# Altium schematic sheet ATRACK_HOST_V1.SchDoc
size A4
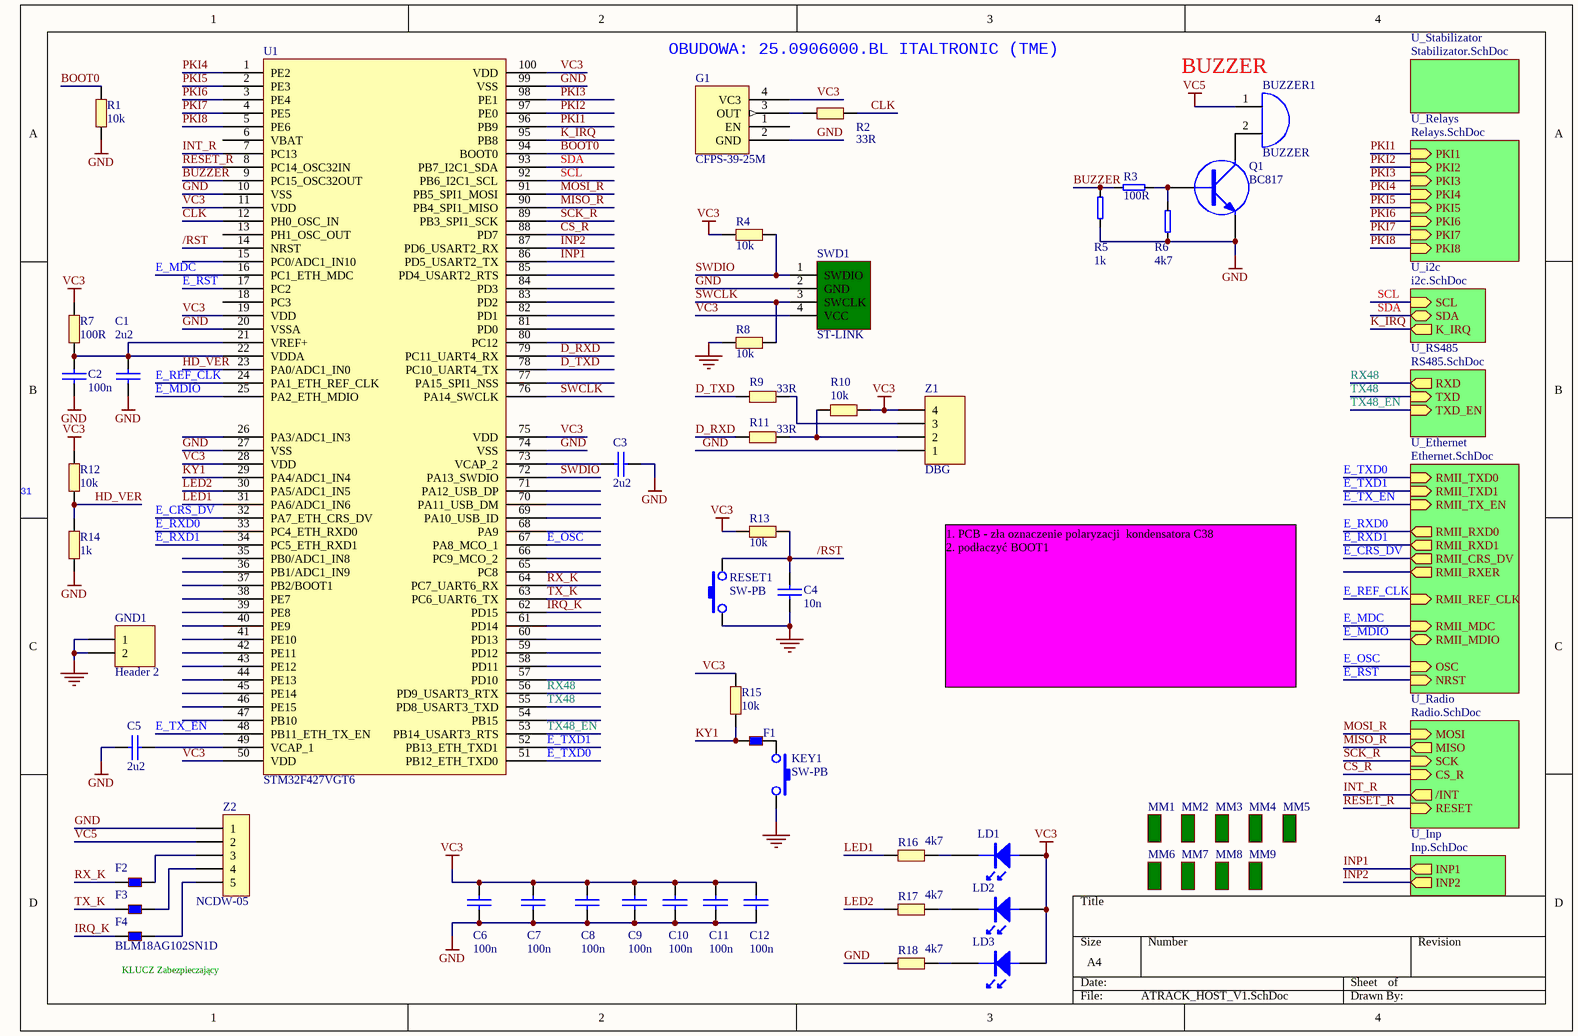
[diagram p0: ATRACK_HOST_V1.SchDoc]

## Parts
BUZZER1  BUZZER  [BMT-1205H09B]
C1  2u2  [0603C]
C2  100n  [0603C]
C3  2u2  [0603C]
C4  10n  [0603C]
C5  2u2  [0603C]
C6  100n  [0603C]
C7  100n  [0603C]
C8  100n  [0603C]
C9  100n  [0603C]
C10  100n  [0603C]
C11  100n  [0603C]
C12  100n  [0603C]
F1  BLM18BB141SN1D  [0603L]  (value not drawn)
F2  BLM18AG102SN1D  [0603L]  (value not drawn)
F3  BLM18AG102SN1D  [0603L]  (value not drawn)
F4  BLM18AG102SN1D  [0603L]
G1  CFPS-39-25M  [GEN_SMD1_1]
GND1  Header 2  [HDR1X2]
KEY1  SW-PB  [DTSM31N_2]
LD1  (no value)  [0805LG]
LD2  (no value)  [0805LR]
LD3  (no value)  [0805LG]
MM1  (no value)  [REF_CIR]
MM2  (no value)  [REF_CIR]
MM3  (no value)  [REF_SQR]
MM4  (no value)  [REF_SQR]
MM5  (no value)  [PB_FREE_GRAF]
MM6  (no value)  [REF_CIR]
MM7  (no value)  [REF_CIR]
MM8  (no value)  [REF_SQR]
MM9  (no value)  [REF_SQR]
Q1  BC817  [SOT23-3Q]
R1  10k  [0603R]
R2  33R  [0603R]
R3  100R  [0603R]
R4  10k  [0603R]
R5  1k  [0603R]
R6  4k7  [0603R]
R7  100R  [0603R]
R8  10k  [0603R]
R9  33R  [0603R]
R10  10k  [0603R]
R11  33R  [0603R]
R12  10k  [0603R]
R13  10k  [0603R]
R14  1k  [0603R]
R15  10k  [0603R]
R16  4k7  [0603R]
R17  4k7  [0603R]
R18  4k7  [0603R]
RESET1  SW-PB  [DTSM31N_2]
SWD1  ST-LINK  [PIN4]
U1  STM32F427VGT6  [VQ100_2]
Z1  DBG  [PIN4]
Z2  NCDW-05  [KEY_LOG]

## Sub-sheets
U_Ethernet = Ethernet.SchDoc: RMII_TXD0 (in), RMII_TX_EN (in), RMII_RXD0 (out), RMII_REF_CLK (in), RMII_CRS_DV (out), RMII_MDC (in), RMII_MDIO (bidir), NRST (in), RMII_TXD1 (in), RMII_RXD1 (out), RMII_RXER (out), OSC (in)
U_i2c = i2c.SchDoc: SCL (in), SDA (bidir), K_IRQ (out)
U_Inp = Inp.SchDoc: INP1 (out), INP2 (out)
U_Radio = Radio.SchDoc: CS_R (in), MOSI (in), MISO (out), SCK (in), RESET (in), /INT (out)
U_Relays = Relays.SchDoc: PKI1 (in), PKI2 (in), PKI3 (in), PKI4 (in), PKI5 (in), PKI6 (in), PKI7 (in), PKI8 (in)
U_RS485 = RS485.SchDoc: TXD (in), TXD_EN (in), RXD (out)
U_Stabilizator = Stabilizator.SchDoc: no entries

## Nets
GND: C1.2 C2.2 C3.1 C4.2 C5.1 C6.2 C7.2 C8.2 C9.2 C10.2 C11.2 C12.2 G1.2(GND) GND1.1 GND1.2 KEY1.2 Q1.E R1.2 R5.2 R6.2 R8.1 R14.1 R18.2 RESET1.1 SWD1.2(GND) U1.10(VSS) U1.20(VSSA) U1.27(VSS) U1.74(VSS) U1.99(VSS) Z1.1 Z2.1
VC3: C6.1 C7.1 C8.1 C9.1 C10.1 C11.1 C12.1 G1.4(VC3) LD1.A LD2.A LD3.A R4.1 R7.2 R10.2 R12.2 R13.1 R15.2 SWD1.4(VCC) U1.11(VDD) U1.19(VDD) U1.28(VDD) U1.50(VDD) U1.75(VDD) U1.100(VDD) Z1.4
VC5: BUZZER1.1 Z2.2
/RST: C4.1 R13.2 RESET1.2 U1.14(NRST)
BOOT0: R1.1 U1.94(BOOT0)
BUZZER: R3.2 R5.1 U1.9(PC15_OSC32OUT)
CLK: R2.2 U1.12(PH0_OSC_IN)
CS_R: U1.88(PD7) ; sheet U_Radio/CS_R
D_RXD: R11.2 U1.79(PC11_UART4_RX)
D_TXD: R9.2 U1.78(PC10_UART4_TX)
E_CRS_DV: U1.32(PA7_ETH_CRS_DV) ; sheet U_Ethernet/RMII_CRS_DV
E_MDC: U1.16(PC1_ETH_MDC) ; sheet U_Ethernet/RMII_MDC
E_MDIO: U1.25(PA2_ETH_MDIO) ; sheet U_Ethernet/RMII_MDIO
E_OSC: U1.67(PA8_MCO_1) ; sheet U_Ethernet/OSC
E_REF_CLK: U1.24(PA1_ETH_REF_CLK) ; sheet U_Ethernet/RMII_REF_CLK
E_RST: U1.17(PC2) ; sheet U_Ethernet/NRST
E_RXD0: U1.33(PC4_ETH_RXD0) ; sheet U_Ethernet/RMII_RXD0
E_RXD1: U1.34(PC5_ETH_RXD1) ; sheet U_Ethernet/RMII_RXD1
E_TX_EN: U1.48(PB11_ETH_TX_EN) ; sheet U_Ethernet/RMII_TX_EN
E_TXD0: U1.51(PB12_ETH_TXD0) ; sheet U_Ethernet/RMII_TXD0
E_TXD1: U1.52(PB13_ETH_TXD1) ; sheet U_Ethernet/RMII_TXD1
HD_VER: R12.1 R14.2 U1.23(PA0/ADC1_IN0)
INP1: U1.86(PD5_USART2_TX) ; sheet U_Inp/INP1
INP2: U1.87(PD6_USART2_RX) ; sheet U_Inp/INP2
INT_R: U1.7(PC13) ; sheet U_Radio//INT
IRQ_K: F4.1 U1.62(PD15)
K_IRQ: U1.95(PB8) ; sheet U_i2c/K_IRQ
KY1: F1.2 R15.1 U1.29(PA4/ADC1_IN4)
LED1: R16.2 U1.31(PA6/ADC1_IN6)
LED2: R17.2 U1.30(PA5/ADC1_IN5)
MISO_R: U1.90(PB4_SPI1_MISO) ; sheet U_Radio/MISO
MOSI_R: U1.91(PB5_SPI1_MOSI) ; sheet U_Radio/MOSI
PKI1: U1.96(PB9) ; sheet U_Relays/PKI1
PKI2: U1.97(PE0) ; sheet U_Relays/PKI2
PKI3: U1.98(PE1) ; sheet U_Relays/PKI3
PKI4: U1.1(PE2) ; sheet U_Relays/PKI4
PKI5: U1.2(PE3) ; sheet U_Relays/PKI5
PKI6: U1.3(PE4) ; sheet U_Relays/PKI6
PKI7: U1.4(PE5) ; sheet U_Relays/PKI7
PKI8: U1.5(PE6) ; sheet U_Relays/PKI8
RESET_R: U1.8(PC14_OSC32IN) ; sheet U_Radio/RESET
RX48: U1.56(PD9_USART3_RTX) ; sheet U_RS485/RXD
RX_K: F2.1 U1.64(PC7_UART6_RX)
SCK_R: U1.89(PB3_SPI1_SCK) ; sheet U_Radio/SCK
SCL: U1.92(PB6_I2C1_SCL) ; sheet U_i2c/SCL
SDA: U1.93(PB7_I2C1_SDA) ; sheet U_i2c/SDA
SWCLK: R8.2 SWD1.3(SWCLK) U1.76(PA14_SWCLK)
SWDIO: R4.2 SWD1.1(SWDIO) U1.72(PA13_SWDIO)
TX48: U1.55(PD8_USART3_TXD) ; sheet U_RS485/TXD
TX48_EN: U1.53(PB14_USART3_RTS) ; sheet U_RS485/TXD_EN
TX_K: F3.1 U1.63(PC6_UART6_TX)
NetBUZZER1_2: BUZZER1.2 Q1.C
NetC1_1: C1.1 C2.1 R7.1 U1.21(VREF+) U1.22(VDDA)
NetC3_2: C3.2 U1.73(VCAP_2)
NetC5_2: C5.2 U1.49(VCAP_1)
NetF1_1: F1.1 KEY1.1
NetF2_2: F2.2 Z2.3
NetF3_2: F3.2 Z2.4
NetF4_2: F4.2 Z2.5
NetG1_3: G1.3(OUT) R2.1
NetLD1_K: LD1.K R16.1
NetLD2_K: LD2.K R17.1
NetLD3_K: LD3.K R18.1
NetQ1_B: Q1.B R3.1 R6.1
NetR9_1: R9.1 Z1.3
NetR10_1: R10.1 R11.1 Z1.2

Not connected (* = marked no-connect by the designer): G1 1(EN); U1 6(VBAT) 13(PH1_OSC_OUT) 15(PC0/ADC1_IN10) 18(PC3) 26(PA3/ADC1_IN3) 35(PB0/ADC1_IN8) 36(PB1/ADC1_IN9) 37(PB2/BOOT1) 38(PE7) 39(PE8) 40(PE9) 41(PE10) 42(PE11) 43(PE12) 44(PE13) 45(PE14) 46(PE15) 47(PB10) 54(PB15) 57(PD10) 58(PD11) 59(PD12) 60(PD13) 61(PD14) 65(PC8) 66(PC9_MCO_2) 68(PA9) 69(PA10_USB_ID) 70(PA11_USB_DM) 71(PA12_USB_DP) 77(PA15_SPI1_NSS) 80(PC12) 81(PD0) 82(PD1) 83(PD2) 84(PD3) 85(PD4_USART2_RTS)

## Notes on the sheet
- OBUDOWA: 25.0906000.BL ITALTRONIC (TME)
- (near BUZZER1) BUZZER
- 31
- 1. PCB - zła oznaczenie polaryzacji  kondensatora C38
  2. podłaczyć BOOT1
- (near F4) KLUCZ Zabezpieczający

## Library data of the parts
C1-C12 = CAP: Capacitor
F1-F4 = KORALIK: Koralik ferrytowy
G1 = GENER_SMD
GND1 = Header 2: Header, 2-Pin; LatestRevisionDate: 17-Jul-2002; LatestRevisionNote: Re-released for DXP Platform.; Publisher: Altium Limited
LD1-LD3 = LED
MM1-MM9 = MECH
Q1 = NPN-SOT23: NPN Transistor
R1 R2 R4 R7-R18 = RES3
R3 R5 R6 = R
SWD1 = SW_CON: Header, 4-Pin; LatestRevisionDate: 17-Jul-2002; LatestRevisionNote: Re-released for DXP Platform.; Publisher: Altium Limited
U1 = STM32F427_LQFP100
Z1 = Header 4: Header, 4-Pin; LatestRevisionDate: 17-Jul-2002; LatestRevisionNote: Re-released for DXP Platform.; Publisher: Altium Limited
Z2 = CON5: Connector